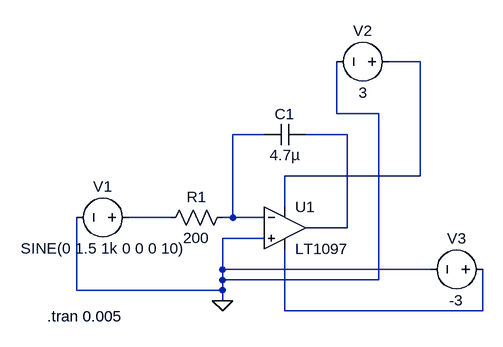
[diagram p0: schematic integrator.asc]
integrator.asc, the LTspice schematic file:
Version 4
SHEET 1 880 680
WIRE 432 -224 384 -224
WIRE 304 -144 304 -224
WIRE 368 -144 304 -144
WIRE 192 -112 144 -112
WIRE 320 -112 256 -112
WIRE 432 -48 432 -224
WIRE 432 -48 224 -48
WIRE 224 0 224 -48
WIRE 48 16 -16 16
WIRE 144 16 144 -112
WIRE 144 16 128 16
WIRE 192 16 144 16
WIRE 320 32 320 -112
WIRE 320 32 256 32
WIRE 192 48 128 48
WIRE 128 96 128 48
WIRE 448 96 128 96
WIRE 128 112 128 96
WIRE 368 112 368 -144
WIRE 368 112 128 112
WIRE -96 128 -96 16
WIRE 128 128 128 112
WIRE 128 128 -96 128
WIRE 128 144 128 128
WIRE 224 160 224 64
WIRE 528 160 528 96
WIRE 528 160 224 160
FLAG 128 144 0
SYMBOL Opamps\\LT1097 224 -32 R0
SYMATTR InstName U1
SYMBOL cap 256 -128 R90
WINDOW 0 0 32 VBottom 2
WINDOW 3 32 32 VTop 2
SYMATTR InstName C1
SYMATTR Value 4.7µ
SYMBOL voltage 0 16 R90
WINDOW 0 -32 56 VBottom 2
WINDOW 3 32 56 VTop 2
WINDOW 123 0 0 Left 0
WINDOW 39 0 0 Left 0
SYMATTR InstName V1
SYMATTR Value SINE(0 1.5 1k 0 0 0 10)
SYMBOL voltage 400 -224 R90
WINDOW 0 -32 56 VBottom 2
WINDOW 3 32 56 VTop 2
WINDOW 123 0 0 Left 0
WINDOW 39 0 0 Left 0
SYMATTR InstName V2
SYMATTR Value 3
SYMBOL res 144 0 R90
WINDOW 0 0 56 VBottom 2
WINDOW 3 32 56 VTop 2
SYMATTR InstName R1
SYMATTR Value 200
SYMBOL voltage 544 96 R90
WINDOW 0 -32 56 VBottom 2
WINDOW 3 32 56 VTop 2
WINDOW 123 0 0 Left 0
WINDOW 39 0 0 Left 0
SYMATTR InstName V3
SYMATTR Value -3
TEXT -142 168 Left 2 !.tran 0.005

The netlist it stands for:
* integrator.asc
XU1 0 N002 N001 N005 N003 LT1097  ; pins In+ In- V+ V- OUT
C1 N003 N002 4.7µ
V1 N004 0 SINE(0 1.5 1k 0 0 0 10)
V2 N001 0 3
R1 N002 N004 200
V3 N005 0 -3
.tran 0.005
.backanno
.end